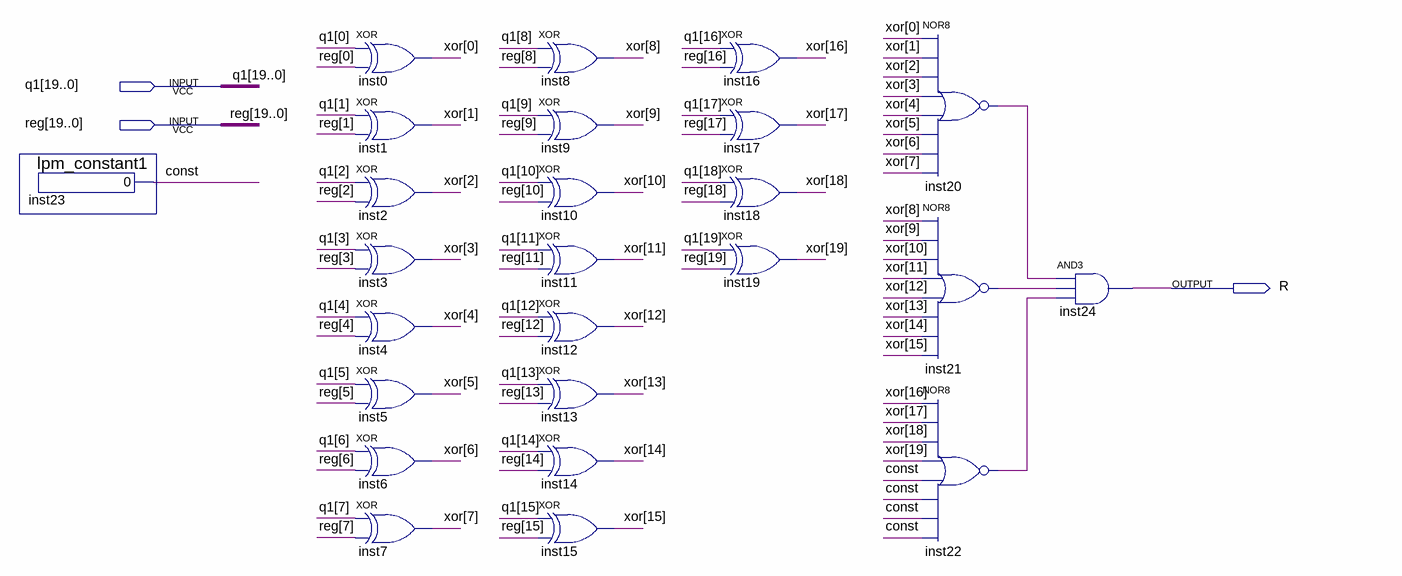
[diagram p0: schematic sheet]
// Quartus schematic Comparing-Sheme.bdf as structural Verilog: 25 symbols, 3 pins
module \Comparing-Sheme  (
  input  [19:0] q1,
  input  [19:0] \reg ,
  output R
);

  wire \const , inst20_out, inst21_out, inst22_out;
  wire [19:0] \xor ;

  lpm_constant1 inst23 (.result(\const ));
  xor inst0 (\xor [0], q1[0], \reg [0]);
  xor inst1 (\xor [1], q1[1], \reg [1]);
  xor inst2 (\xor [2], q1[2], \reg [2]);
  xor inst3 (\xor [3], q1[3], \reg [3]);
  xor inst4 (\xor [4], q1[4], \reg [4]);
  xor inst5 (\xor [5], q1[5], \reg [5]);
  xor inst6 (\xor [6], q1[6], \reg [6]);
  xor inst7 (\xor [7], q1[7], \reg [7]);
  xor inst8 (\xor [8], q1[8], \reg [8]);
  xor inst9 (\xor [9], q1[9], \reg [9]);
  xor inst10 (\xor [10], q1[10], \reg [10]);
  xor inst11 (\xor [11], q1[11], \reg [11]);
  xor inst12 (\xor [12], q1[12], \reg [12]);
  xor inst13 (\xor [13], q1[13], \reg [13]);
  xor inst14 (\xor [14], q1[14], \reg [14]);
  xor inst15 (\xor [15], q1[15], \reg [15]);
  xor inst16 (\xor [16], q1[16], \reg [16]);
  xor inst17 (\xor [17], q1[17], \reg [17]);
  xor inst18 (\xor [18], q1[18], \reg [18]);
  xor inst19 (\xor [19], q1[19], \reg [19]);
  nor inst20 (inst20_out, \xor [0], \xor [1], \xor [2], \xor [3], \xor [4], \xor [5], \xor [6], \xor [7]);
  nor inst21 (inst21_out, \xor [8], \xor [9], \xor [10], \xor [11], \xor [12], \xor [13], \xor [14], \xor [15]);
  nor inst22 (inst22_out, \xor [16], \xor [17], \xor [18], \xor [19], \const , \const , \const , \const );
  and inst24 (R, inst20_out, inst21_out, inst22_out);
endmodule
